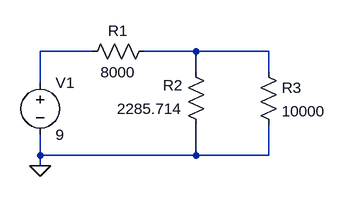
[diagram p0: schematic Lab1_2B_2_10000.asc]
Lab1_2B_2_10000.asc, the LTspice schematic file:
Version 4
SHEET 1 880 680
WIRE 128 96 48 96
WIRE 288 96 208 96
WIRE 400 96 288 96
WIRE 288 128 288 96
WIRE 400 128 400 96
WIRE 48 144 48 96
WIRE 48 256 48 224
WIRE 288 256 288 208
WIRE 288 256 48 256
WIRE 400 256 400 208
WIRE 400 256 288 256
WIRE 48 272 48 256
FLAG 48 272 0
SYMBOL voltage 48 128 R0
WINDOW 123 0 0 Left 0
WINDOW 39 0 0 Left 0
SYMATTR InstName V1
SYMATTR Value 9
SYMBOL Res 112 112 R270
WINDOW 0 32 56 VTop 2
WINDOW 3 0 56 VBottom 2
SYMATTR InstName R1
SYMATTR Value 8000
SYMBOL Res 304 224 R180
WINDOW 0 36 76 Left 2
WINDOW 3 36 40 Left 2
SYMATTR InstName R2
SYMATTR Value 2285.714
SYMBOL Res 384 112 R0
SYMATTR InstName R3
SYMATTR Value 10000

The netlist it stands for:
* Lab1_2B_2_10000.asc
V1 N001 0 9
R1 N001 N002 8000
R2 0 N002 2285.714
R3 N002 0 10000
.backanno
.end